# Altium schematic sheet Sensors.SchDoc
size A4
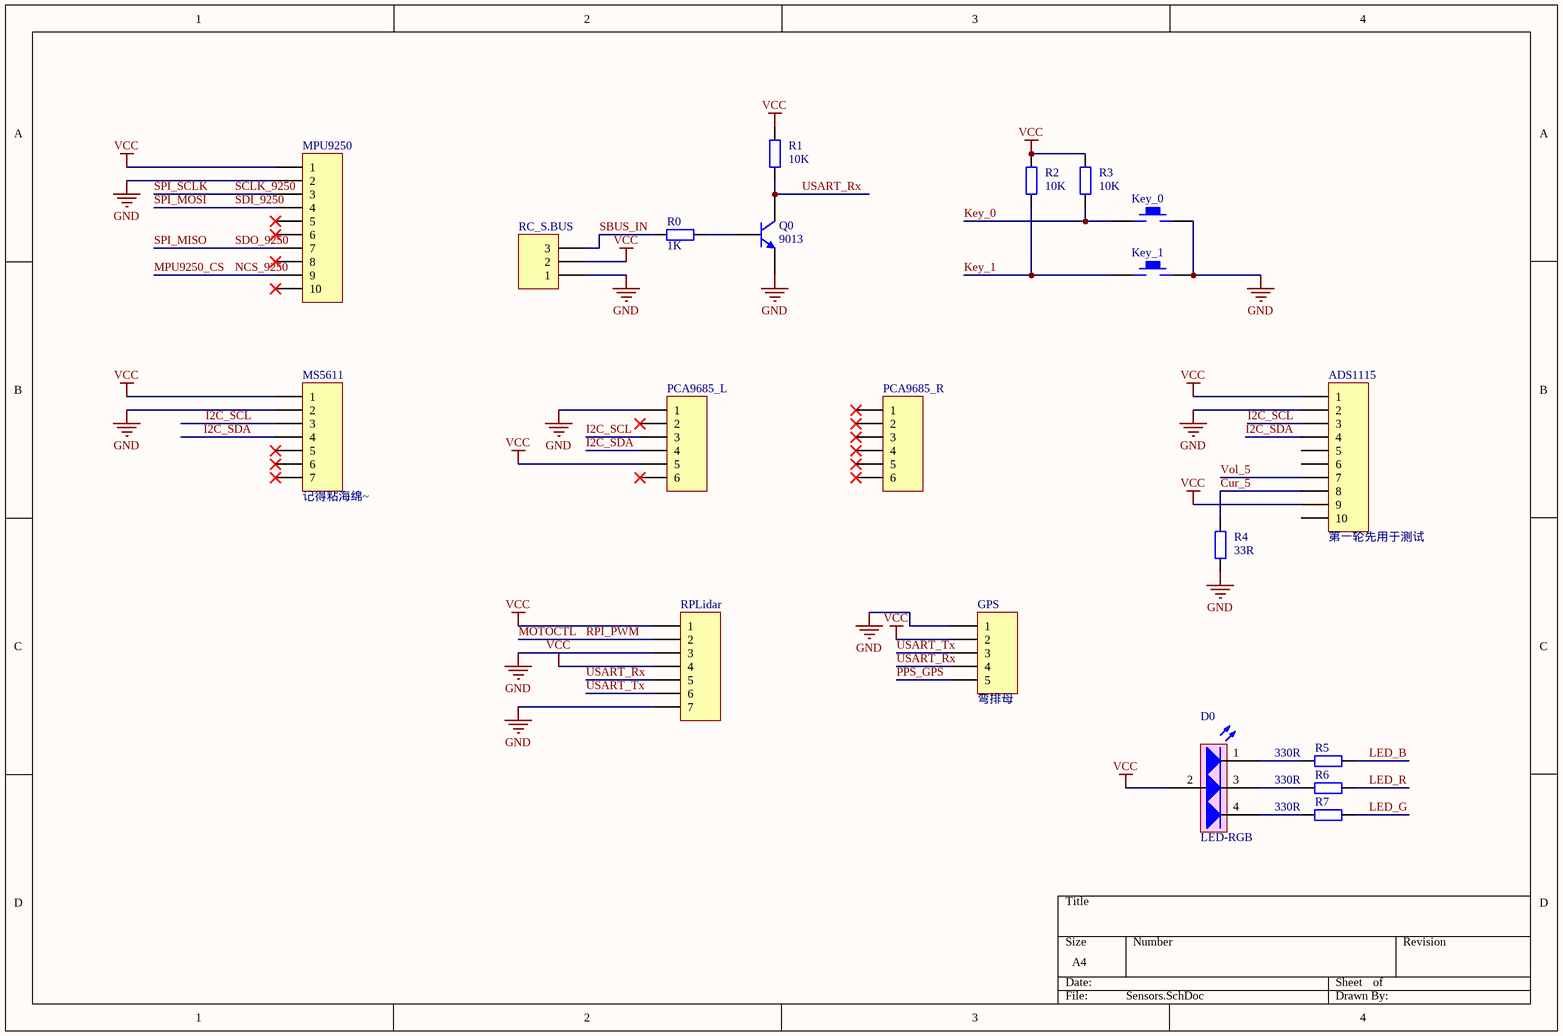
[diagram p0: Sensors.SchDoc]

## Parts
ADS1115  第一轮先用于测试  [HDR1X10]
D0  LED-RGB  [LED_5050_RGB]
GPS  弯排母  [HDR1X5]
Key_0  (no value)  [KEY_M]
Key_1  (no value)  [KEY_M]
MPU9250  Header 10  [HDR1X10]  (value not drawn)
MS5611  记得粘海绵~  [HDR1X7]
PCA9685_L  Header 6  [HDR1X6]  (value not drawn)
PCA9685_R  Header 6  [HDR1X6]  (value not drawn)
Q0  9013  [SOT23_L]
R0  value 1K  [0805]  (hidden comment: Res2)
R1  value 10K  [0805]  (hidden comment: Res2)
R2  value 10K  [0805]  (hidden comment: Res2)
R3  value 10K  [0805]  (hidden comment: Res2)
R4  value 33R  [0805]  (hidden comment: Res2)
R5  value 330R  [0805]  (hidden comment: Res2)
R6  value 330R  [0805]  (hidden comment: Res2)
R7  value 330R  [0805]  (hidden comment: Res2)
RC_S.BUS  Header 3  [HDR1X3]  (value not drawn)
RPLidar  Header 7  [HDR1X7]  (value not drawn)

## Nets
GND: ADS1115.2 GPS.1 Key_0.2 Key_1.2 MPU9250.2 MS5611.2 PCA9685_L.1 Q0.3(C) R4.1 RC_S.BUS.1 RPLidar.3 RPLidar.7
VCC: ADS1115.1 ADS1115.9 D0.2(A) GPS.2 MPU9250.1 MS5611.1 PCA9685_L.5 R1.2 R2.2 R3.2 RC_S.BUS.2 RPLidar.1 RPLidar.4
Cur_5: ADS1115.8 R4.2
I2C_SCL: ADS1115.3 MS5611.3 PCA9685_L.3
I2C_SDA: ADS1115.4 MS5611.4 PCA9685_L.4
Key_0: Key_0.1 R3.1
Key_1: Key_1.1 R2.1
LED_B: R5.1
LED_G: R7.1
LED_R: R6.1
MOTOCTL: RPLidar.2  [also labelled RPI_PWM]
MPU9250_CS: MPU9250.9  [also labelled NCS_9250]
PPS_GPS: GPS.5
SBUS_IN: R0.2 RC_S.BUS.3
SCLK_9250: MPU9250.3  [also labelled SPI_SCLK]
SDI_9250: MPU9250.4  [also labelled SPI_MOSI]
SDO_9250: MPU9250.7  [also labelled SPI_MISO]
USART_Rx: GPS.4 Q0.1(E) R1.1 RPLidar.5
USART_Tx: GPS.3 RPLidar.6
Vol_5: ADS1115.7
NetD0_1: D0.1(R) R5.2
NetD0_3: D0.3(G) R6.2
NetD0_4: D0.4(B) R7.2
NetQ0_2: Q0.2(B) R0.1

Not connected (* = marked no-connect by the designer): ADS1115 5 6 10; MPU9250 5* 6* 8* 10*; MS5611 5* 6* 7*; PCA9685_L 2* 6*; PCA9685_R 1* 2* 3* 4* 5* 6*

## Library data of the parts
ADS1115 MPU9250 = Header 10: Header, 10-Pin; LatestRevisionDate: 17-Jul-2002; LatestRevisionNote: Re-released for DXP Platform.; Publisher: Altium Limited
D0 = LED-RGB: 三基色LED; pin to pad: 1>K1 2>A 3>K2 4>K3; Published: 8-Jun-2000; LatestRevisionDate: 08-Jul-2005; LatestRevisionNote: Mech Layer 1 removed.; PackageReference: LED-0; Publisher: Altium Limited
GPS = Header 5: Header, 5-Pin; LatestRevisionDate: 17-Jul-2002; LatestRevisionNote: Re-released for DXP Platform.; Publisher: Altium Limited
Key_0 Key_1 = KEY_M
MS5611 RPLidar = Header 7: Header, 7-Pin; LatestRevisionDate: 17-Jul-2002; LatestRevisionNote: Re-released for DXP Platform.; Publisher: Altium Limited
PCA9685_L PCA9685_R = Header 6: Header, 6-Pin; LatestRevisionDate: 17-Jul-2002; LatestRevisionNote: Re-released for DXP Platform.; Publisher: Altium Limited
Q0 = 2N3904: NPN General Purpose Amplifier; pin to pad: 2>3 3>2; Published: 8-Jun-2000; LatestRevisionDate: 15-Jan-2003; LatestRevisionNote: PCB Footprint 'BCY-W3/D4.7' replaced; DatasheetVersion: 1997; PackageVersion: Sep-1998; PackageReference: TO-92A; Publisher: Altium Limited; PackageDescription: TO, Flat Index; 3 In-Line, Axial Leads; Body Dia. 4.5mm; Leads 0.51 x 0.48 mm (max); ComponentLink1Description: Manufacturer Link; ComponentLink1URL: http://www.fairchildsemi.com/; ComponentLink2Description: Datasheet; ComponentLink2URL: http://www.fairchildsemi.com/ds/2N%2F2N3904.pdf
R0-R7 = Res2: Resistor; Published: 8-Jun-2000; LatestRevisionDate: 17-Jul-2002; LatestRevisionNote: Re-released for DXP Platform.; PackageReference: AXIAL-0.4; Publisher: Altium Limited; PackageDescription: Axial Device, Thru-Hole; 2 Leads; 0.4 in Pin Spacing
RC_S.BUS = Header 3: Header, 3-Pin; LatestRevisionDate: 17-Jul-2002; LatestRevisionNote: Re-released for DXP Platform.; Publisher: Altium Limited